# Altium schematic sheet top.SchDoc
size 420 x 297 mm; SheetNumber: 1; SheetTotal: 1
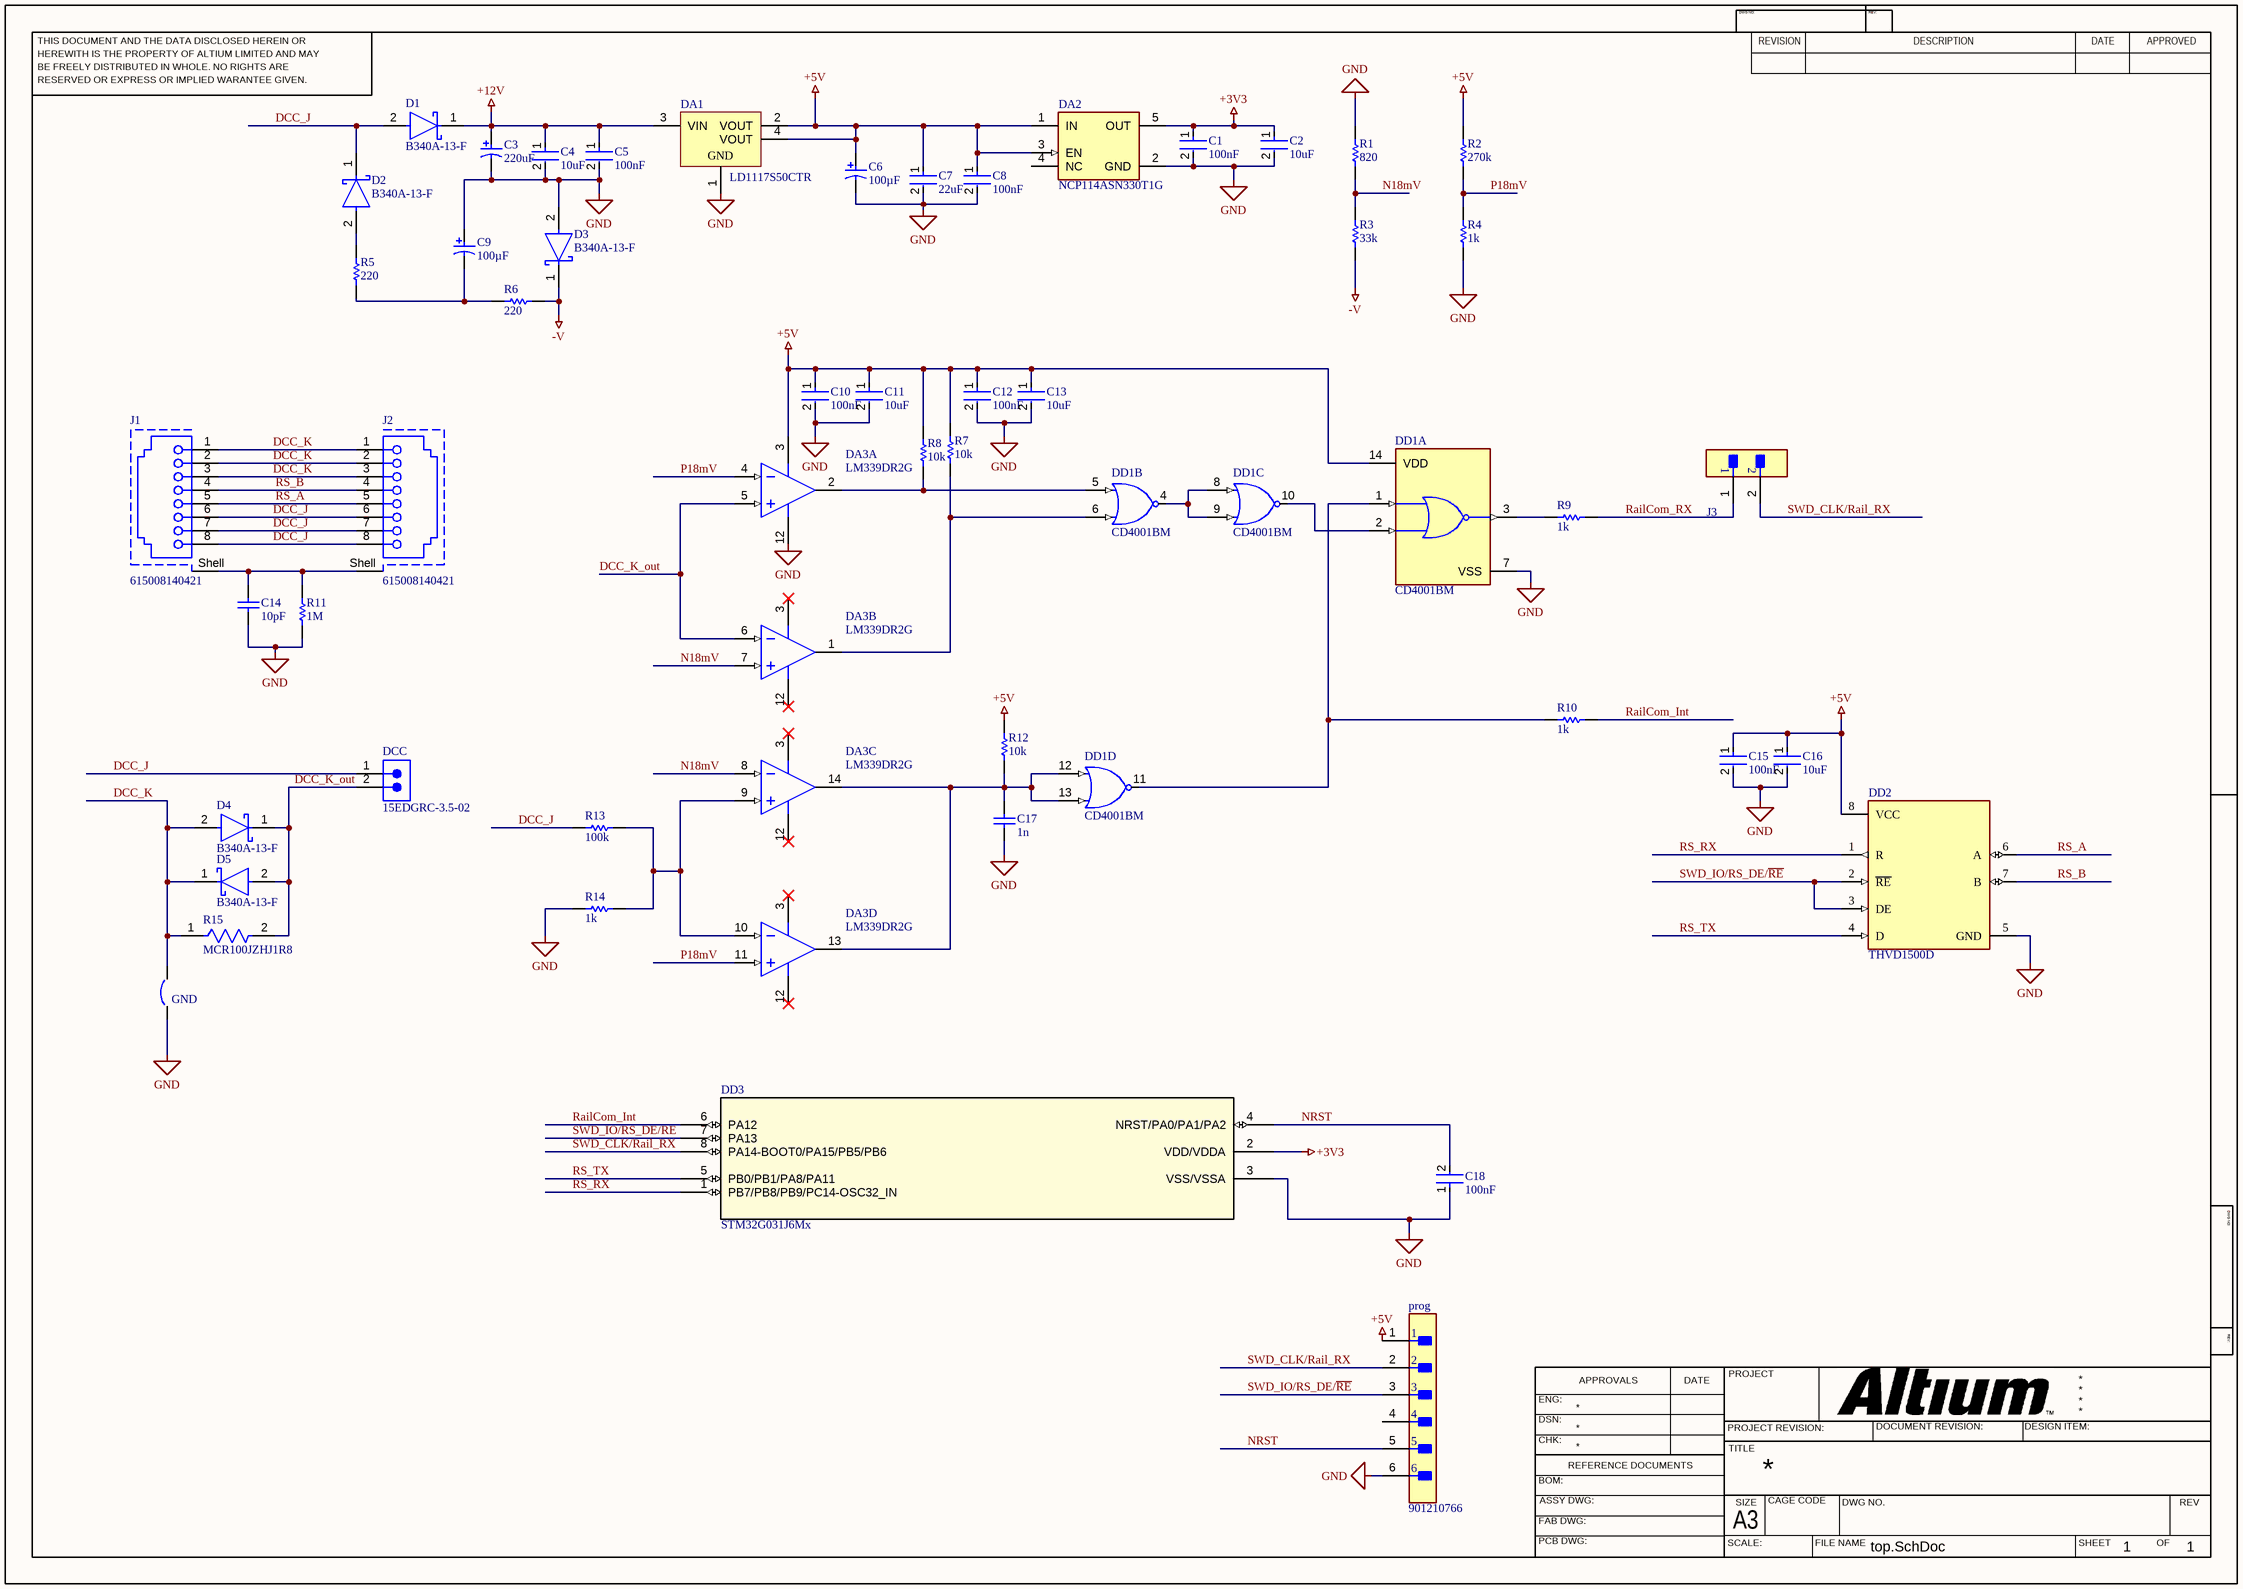
[diagram p0: top.SchDoc]

## Parts
C1  Capacitance: 100nF  [FP-CGA3E-0_3-0_1-IPC_C]  (hidden comment: CGA3E2X7R1H104K080AA)
C2  Capacitance: 10uF  [FP-GRM188-0_1-e0_2_0_55-IPC_C]  (hidden comment: GRM188R60J106ME47D)
C3  value 220uF  [PNSC-EEE-FK1E221P_N]  (hidden comment: EEE-FK1E221P)
C4  Capacitance: 10uF  [FP-GRM188-0_1-e0_2_0_55-IPC_C]  (hidden comment: GRM188R60J106ME47D)
C5  Capacitance: 100nF  [FP-CGA3E-0_3-0_1-IPC_C]  (hidden comment: CGA3E2X7R1H104K080AA)
C6  Capacitance: 100µF  [PNSC-FK-V-D8_V]  (hidden comment: EEEFK1E101XP)
C7  Capacitance: 22uF  [FP-GRM188-0_2-IPC_C]  (hidden comment: GRM188R61A226ME15D)
C8  Capacitance: 100nF  [FP-CGA3E-0_3-0_1-IPC_C]  (hidden comment: CGA3E2X7R1H104K080AA)
C9  Capacitance: 100µF  [PNSC-FK-V-D8_V]  (hidden comment: EEEFK1E101XP)
C10  Capacitance: 100nF  [FP-CGA3E-0_3-0_1-IPC_C]  (hidden comment: CGA3E2X7R1H104K080AA)
C11  Capacitance: 10uF  [FP-GRM188-0_1-e0_2_0_55-IPC_C]  (hidden comment: GRM188R60J106ME47D)
C12  Capacitance: 100nF  [FP-CGA3E-0_3-0_1-IPC_C]  (hidden comment: CGA3E2X7R1H104K080AA)
C13  Capacitance: 10uF  [FP-GRM188-0_1-e0_2_0_55-IPC_C]  (hidden comment: GRM188R60J106ME47D)
C14  value 10pF  [CAPC0603(1608)100_N]  (hidden comment: CAP 10pF 25V 0603(1608))
C15  Capacitance: 100nF  [FP-CGA3E-0_3-0_1-IPC_C]  (hidden comment: CGA3E2X7R1H104K080AA)
C16  Capacitance: 10uF  [FP-GRM188-0_1-e0_2_0_55-IPC_C]  (hidden comment: GRM188R60J106ME47D)
C17  value 1n  [CAPC1608X90X35NL10T15]  (hidden comment: GRM188R71H102KA01D)
C18  Capacitance: 100nF  [FP-CGA3E-0_3-0_1-MFG]  (hidden comment: CGA3E2X7R1H104K080AA)
D1  B340A-13-F  [FP-SMA-MFG]
D2  B340A-13-F  [FP-SMA-MFG]
D3  B340A-13-F  [FP-SMA-MFG]
D4  B340A-13-F  [FP-SMA-MFG]
D5  B340A-13-F  [FP-SMA-MFG]
DA1  LD1117S50CTR  [SOT-223_N]
DA2  NCP114ASN330T1G  [FP-483-MFG]
DA3  LM339DR2G  [ONSC-SOIC-14-751A-03_V]  (parts A,B,C,D of 4)
DCC  15EDGRC-3.5-02  [691305140002]
DD1  CD4001BM  [FP-D0014A-MFG]  (parts A,B,C,D of 4)
DD2  THVD1500D  [FP-D0008B-IPC_A]
DD3  STM32G031J6Mx  [SO-8]
GND  (no value)  [JP_SMD]
J1  615008140421  [615008140421]
J2  615008140421  [615008140421]
J3  M20-9990245  [FP-M20-9990245-MFG]  (value not drawn)
prog  901210766  [FP-901210766-MFG]
R1  value 820  [RESC1608X55X30NL15T15]  (hidden comment: ERJ3EKF8203V)
R2  value 270k  [RESC1608X55X30NL20T10]  (hidden comment: RK73H1JTTD2703F)
R3  value 33k  [RESC1608X55X30NL20T20]  (hidden comment: ERA3AEB333V)
R4  value 1k  [RESC1608X55X30NL15T15]  (hidden comment: ERJ-3EKF1001V)
R5  value 220  [RESC1608X55X30NL15T15]  (hidden comment: ERJ-3EKF2200V)
R6  value 220  [RESC1608X55X30NL15T15]  (hidden comment: ERJ-3EKF2200V)
R7  value 10k  [RESC1609X55X30NL15T15]  (hidden comment: ERJ3EKF1002V)
R8  value 10k  [RESC1609X55X30NL15T15]  (hidden comment: ERJ3EKF1002V)
R9  value 1k  [RESC1608X55X30NL15T15]  (hidden comment: ERJ-3EKF1001V)
R10  value 1k  [RESC1608X55X30NL15T15]  (hidden comment: ERJ-3EKF1001V)
R11  value 1M  [RESC1608X55X25NL10T15]  (hidden comment: RC0603FR-071ML)
R12  value 10k  [RESC1609X55X30NL15T15]  (hidden comment: ERJ3EKF1002V)
R13  value 100k  [RESC1608X55X30NL15T15]  (hidden comment: ERJ-3EKF1003V)
R14  value 1k  [RESC1608X55X30NL15T15]  (hidden comment: ERJ-3EKF1001V)
R15  MCR100JZHJ1R8  [FP-MCR100-IPC_C]

## Nets
+3V3: C1.1 C2.1 DA2.5(OUT) DD3.2(VDD/VDDA)
+5V: C6.1 C7.1 C8.1 C10.1 C11.1 C12.1 C13.1 C15.1 C16.1 DA1.2(VOUT) DA1.4(VOUT) DA2.1(IN) DA2.3(EN) DA3.3(VCC) DD1.14(VDD) DD2.8(VCC) prog.1 R2.2 R7.1 R8.1 R12.1
+12V: C3.1 C4.1 C5.1 D1.1(C) DA1.3(VIN)
-V: D3.1(C) R3.1 R6.2
GND: C1.2 C2.2 C3.2 C4.2 C5.2 C6.2 C7.2 C8.2 C9.1 C10.2 C11.2 C12.2 C13.2 C14.2 C15.2 C16.2 C17.1 C18.1 D3.2(A) DA1.1(GND) DA2.2(GND) DA3.12(GND) DD1.7(VSS) DD2.5(GND) DD3.3(VSS/VSSA) GND.1 prog.6 R1.2 R4.1 R11.2 R14.2
DCC_J: D1.2(A) D2.1(C) DCC.1 J1.6 J1.7 J1.8 J2.6 J2.7 J2.8 R13.2
DCC_K: D4.2(A) D5.1(C) GND.2 J1.1 J1.2 J1.3 J2.1 J2.2 J2.3 R15.1
DCC_K_out: D4.1(C) D5.2(A) DA3.5(IN1+) DA3.6(IN2-) DCC.2 R15.2
N18mV: DA3.7(IN2+) DA3.8(IN3-) R1.1 R3.2
NRST: C18.2 DD3.4(NRST/PA0/PA1/PA2) prog.5
P18mV: DA3.4(IN1-) DA3.11(IN4+) R2.1 R4.2
RailCom_Int: DD3.6(PA12) R10.1
RailCom_RX: J3.1 R9.1
RS_A: DD2.6(A) J1.5 J2.5
RS_B: DD2.7(B) J1.4 J2.4
RS_RX: DD2.1(R) DD3.1(PB7/PB8/PB9/PC14-OSC32_IN)
RS_TX: DD2.4(D) DD3.5(PB0/PB1/PA8/PA11)
SWD_CLK/Rail_RX: DD3.8(PA14-BOOT0/PA15/PB5/PB6) J3.2 prog.2
SWD_IO/RS_DE/~{RE}: DD2.2(~{RE}) DD2.3(DE) DD3.7(PA13) prog.3
NetC9_2: C9.2 R5.1 R6.1
NetC14_1: C14.1 J1.Shell J2.Shell R11.1
NetC17_2: C17.2 DA3.13(OUT4) DA3.14(OUT3) DD1.12(G) DD1.13(H) R12.2
NetD2_2: D2.2(A) R5.2
NetDA3_1: DA3.1(OUT2) DD1.6(D) R7.2
NetDA3_2: DA3.2(OUT1) DD1.5(C) R8.2
NetDA3_9: DA3.9(IN3+) DA3.10(IN4-) R13.1 R14.1
NetDD1_1: DD1.1(A) DD1.11(M) R10.2
NetDD1_2: DD1.2(B) DD1.10(L)
NetDD1_3: DD1.3(J) R9.2
NetDD1_4: DD1.4(K) DD1.8(E) DD1.9(F)

Not connected (* = marked no-connect by the designer): DA2 4(NC); prog 4

## Notes on the sheet
- THIS DOCUMENT AND THE DATA DISCLOSED HEREIN OR
- HEREWITH IS THE PROPERTY OF ALTIUM LIMITED AND MAY
- DWG NO:
- REVISION
- REV:
- DESCRIPTION
- DATE
- APPROVED
- BE FREELY DISTRIBUTED IN WHOLE. NO RIGHTS ARE
- RESERVED OR EXPRESS OR IMPLIED WARANTEE GIVEN.
- ENG:
- APPROVALS
- PROJECT
- DSN:
- CHK:
- REFERENCE DOCUMENTS
- PROJECT REVISION:
- TITLE
- DOCUMENT REVISION:
- DESIGN ITEM:
- BOM:
- FAB DWG:
- PCB DWG:
- ASSY DWG:
- SCALE:
- A3
- SIZE
- CAGE CODE
- FILE NAME
- DWG NO.
- SHEET
- OF
- REV

## Library data of the parts
C1 C5 C8 C10 C12 C15 C18 = CMP-2000-07546-2: Cap Ceramic 100nF 50V X7R 10% Pad SMD 0603 +125°C Automotive T/R; Weight: 7.1E-05oz; Composition: Ceramic; Max Operating Temperature: 125°C; Termination: SMD/SMT; Dielectric: X7R; Length: 1.6mm; Package Quantity: 1; REACH SVHC: No SVHC; Lead Free: Lead Free; Case Code (Metric): 1608; Min Operating Temperature: -55°C; Packaging: Tape and Reel; Tolerance: 10%; Voltage Rating: 50V; Case Code (Imperial): 0603; Case/Package: 0603; Voltage Rating (DC): 50V; Depth: 0.8mm; Radiation Hardening: No; Ratings: AEC-Q200; Mount: Surface Mount; Voltage: 50V; Thickness: 0.035inch; Width: 0.8mm; Height: 0.8mm
C2 C4 C11 C13 C16 = CMP-2006-02792-2: Chip Multilayer Ceramic Capacitors for General Purpose, 0603, 10uF, X5R, 15%, 20%, 6.3V; Packaging: Tape and Reel; Voltage Rating (DC): 6.3V; Width: 0.031inch; Termination: SMD/SMT; Dielectric: X5R; Package Quantity: 4000; Voltage Rating: 6.3V; Case/Package: 0603; Min Operating Temperature: -55°C; Voltage: 6.3V; Length: 1.6mm; Thickness: 0.035inch; Lead Free: Lead Free; Depth: 0.8mm; Case Code (Imperial): 0603; Max Operating Temperature: 85°C; Material: Ceramic; Height: 0.8mm; Tolerance: 20%; Mount: Surface Mount; REACH SVHC: No SVHC; Radiation Hardening: No; Case Code (Metric): 1608
C3 = CMP-1665-00017-3: Aluminum Electrolytic Capacitor, 220 uF, +/- 20%, 25 V, -55 to 105 degC, 2-Pin CAPAE, RoHS, Tape and Reel; Manufacturer: Panasonic; Voltage Rating: 25 V; ComponentLink2URL: http://industrial.panasonic.com/cdbs/www-data/pdf/RDE0000/ABA0000C1181.pdf; Height: 10.2 mm; Max Operating Temperature: 105 degC; PackageReference: EEE-FK1E221P; ComponentLink1Description: Manufacturer URL; ComponentLink1URL: http://www.panasonic.com/; Mount: Surface Mount; REACH SVHC: No SVHC; Min Operating Temperature: -55 degC; ComponentLink2Description: Datasheet; DatasheetVersion: 03/2016; Length: 10.2 mm; RoHSCompliant: true; Packaging: Tape and Reel; Package Quantity: 500; Lead Pitch: 3.1 mm; Pins: 2; PackageDescription: 2-Pin Electrolytic Aluminum Capacitor, Body 8.3 x 8.3 mm; Mounting Technology: Surface Mount
C6 C9 = CMP-2000-06206-1: Aluminum Electrolytic Capacitor, 100 uF, +/- 20%, 25 V, 2-Pin SMD (Size Code D8), -55 to 105 degC, RoHS, Tape and Reel; Manufacturer: Panasonic; Type: Can; Lifetime@Temperature: 2000Hrs@105°C; Rated Voltage: 25V; Ripple Current: 280mA; Impedance: 0.34O; Case Size/Dimension: Ø6.3x7.7mm; Operating Temp-Max: 105°C; Series: FK; Package URL: http://industrial.panasonic.com/cdbs/www-data/pdf/RDE0000/DME0000COL48.pdf; Mounting Technology: SurfaceMount; Package Description: 2-Pin Electrolytic Aluminum Capacitor, Body 6.6 x 6.6 mm; Datasheet Version: 03/2016; Datasheet URL: http://industrial.panasonic.com/cdbs/www-data/pdf/RDE0000/ABA0000C1181.pdf; Manufacturer URL: http://www.panasonic.com/; Package Reference: FK-V-D8; Operating Temp Range: -55to+105°C
C7 = CMP-2000-06337-3: Chip Multilayer Ceramic Capacitors for General Purpose, 0603, 22uF, X5R, 15%, 20%, 10V; Tolerance: 20%; Weight: 0.000222oz; Material: Ceramic; Depth: 0.8mm; Length: 1.6mm; Termination: SMD/SMT; Packaging: Tape and Reel; Width: 0.8mm; Voltage Rating: 10V; Case Code (Imperial): 0603; Mount: Surface Mount; Voltage Rating (DC): 10V; Case/Package: 0603; Thickness: 0.039inch; REACH SVHC: No SVHC; Dielectric: X5R; Height: 0.8mm; Package Quantity: 4000; Case Code (Metric): 1608; Min Operating Temperature: -55°C; Lead Free: Lead Free; Max Operating Temperature: 85°C
C14 = CMP-1035-00549-1: CAP 10pF 25V ±1% 0603 (1608 Metric) Thickness 1mm SMD; Case-EIA: 0603; Case-Metric: 1608; Tolerance: Â±1%; Technology: SMT; Max Thickness: 1 mm; Rated Voltage: 25 V
C17 = CMP-2006-02891-1: Manufacturer: Murata; Part Number: GRM188R71H102KA01D
D1-D5 = CMP-1667-00003-3: DIODE SCHOTTKY 40V 3A SMA; Max Forward Surge Current (Ifsm): 80A; Forward Voltage: 500mV; Polarity: Standard; Max Reverse Current: 500uA; Capacitance: 250pF; Element Configuration: Single; Mount: Surface Mount; Output Current: 3A; Radiation Hardening: No; Width: 2.92mm; Current Rating: 3A; Termination: SMD/SMT; Voltage: 40V; Series: -; Max Operating Temperature: 125°C; Current: 3A; Max Repetitive Reverse Voltage (Vrrm): 40V; Min Operating Temperature: -55°C; REACH SVHC: No SVHC; Number of Pins: 2; Average Rectified Current: 3A; Contact Plating: Tin; RoHS Compliant: Yes; Max Reverse Voltage (DC): 40V; Packaging: Tape and Reel; Height: 2.3mm; Length: 4.6mm; Case/Package: SMA; Weight: 0.002258oz; Peak Non-Repetitive Surge Current: 80A; Package Quantity: 5000; Lead Free: Lead Free; Forward Current: 3A; Voltage Rating (DC): 40V
DA1 = CMP-0244-00311-1: Fixed Low Drop Positive Voltage Regulator, 5V, 4-Pin SOT-223, Tape and Reel; PackageReference: SOT-223; PackageVersion: 2010; ComponentLink2URL: http://www.st.com/internet/com/TECHNICAL_RESOURCES/TECHNICAL_LITERATURE/DATASHEET/CD00000544.pdf; ComponentLink1URL: http://www.st.com; ComponentLink2Description: Datasheet; DatasheetVersion: 1/11/2011; ComponentLink1Description: Manufacturer URL; PackageDescription: 4-Pin SOT-223 Package, 6.5 x 3.5 mm Body, 2.3 mm Pitch, 7 mm Lead Span
DA2 = CMP-07128-000001-1: IC REG LINEAR 3.3V 300MA 5TSOP; Manufacturer: ON Semiconductor; Dropout Voltage: 150mV; Number Of Outputs: 1; Output Type: Fixed; Standoff Height: 0.01mm; Nominal Supply Current: 50uA; Accuracy Percentage: 1%; Max Junction Temp: +150°C; Min Supply Voltage: 1.7V; Max Supply Voltage: 5.5V; Output Voltage: 3.3V; Device Class L2: Power Management ICs; Digikey Description: IC REG LINEAR 3.3V 300MA 5TSOP; Footprint Url: https://www.onsemi.com/pub/Collateral/483.PDF; Temperature: to +150°C; RoHS: TRUE; Octopart: https://octopart.com/ncp114asn330t1g-on+semiconductor-74628742; Package: 483; Height: 1.1mm; Device Class L1: Integrated Circuits (ICs); Device Class L3: Voltage Regulators - Linear; ComponentLink2URL: https://www.onsemi.com/pub/Collateral/NCP114-D.PDF; Output Current: 300mA; Automotive: No; ComponentLink2Description: Datasheet; Manufacturer Part Number: NCP114ASN330T1G; Category: IC; Lead Free: Yes; Temperature Range High: +150°C
DA3 = CMP-1305-00036-1: Single Supply Quad Comparators, 0 to 70 degC, 14-Pin SOIC, Pb-Free, Tape and Reel; Manufacturer: On Semiconductor; IO Typ (mA): 16; ComponentLink3URL: http://www.onsemi.com/pub_link/Collateral/751A-03.PDF; RoHS: TRUE; Packing: Tape and Reel; ComponentLink2Description: Datasheet; ComponentLink2URL: http://www.onsemi.com/pub_link/Collateral/LM339-D.PDF; ComponentLink1Description: Manufacturer URL; PackageVersion: Rev. K, 05/2011; DatasheetVersion: Rev. 20; PackageReference: SOIC-14-751A-03; ComponentLink1URL: http://www.onsemi.com/; PartNumber: LM339DR2G; PackageDescription: 14-Pin Small Outline Integrated Circuit, Body 8.65 x 3.9 mm, Pitch 1.27 mm; ComponentLink3Description: Package Specification; Mounting Technology: Surface Mount
DCC = CMP-1502-01775-2: NexarPartId: 78871375; Gender: Male; Number of Pins: 2; Packaging: Box; RoHS: Non-Compliant; Lead Pitch: 3.5mm
DD1 = CMP-0806-00066-4: IC GATE NOR 4CH 2-INP 14SOIC; Output Current: 6.8mA; Number of Inputs: 2; Propagation Delay: 90ns; Number of Circuits: 4; Quiescent Current: 5uA; Max Supply Voltage: 18V; Schmitt Trigger Input: No; Min Supply Voltage: 3V; Number of Output Lines: 1; Low Level Output Current: 4.2mA; High Level Output Current: -4.2mA; Number of Elements: 4; Turn-On Delay Time: 90ns; Packaging: Rail/Tube; Mount: Surface Mount; Height: 1.58mm; Number of Bits: 4; Weight: 0.004564oz; Logic Function: NOR; Lead Free: Lead Free; Package Quantity: 50; Radiation Hardening: No; Length: 8.65mm; Min Operating Temperature: -55°C; Case/Package: SOIC; Number of Outputs: 1; Max Operating Temperature: 125°C; REACH SVHC: No SVHC; Contact Plating: Gold; Number of Pins: 14; Width: 3.91mm; Number of Input Lines: 2; Number of Gates: 4
DD2 = CMP-04875-000034-1: IC TRANSCEIVER HALF 1/1 8SOIC; Output Current per Channel: 75mA; Input Offset Voltage (Vos): 200uV; Number of Circuits: 1; Operating Supply Current: 1.6mA; Data Rate: 300Kbps; Receiver Hysteresis: 50mV; Slew Rate: 10V/µs; Simplex/Duplex: Half Duplex; Gain Bandwidth Product: 10MHz; Input Bias Current: 8pA; Case/Package: VSSOP; Max Operating Temperature: 125°C; Mount: Surface Mount; Min Operating Temperature: -40°C; Packaging: Tape and Reel; RoHS Compliant: Yes
DD3 = STM32G031J6Mx: The STM32G031x4/x6/x8 mainstream microcontrollers are based on high-performance Arm® Cortex®-M0+ 32-bit RISC core operating at up to 64 MHz frequency. / 32 Kbytes of Flash program memory and 8 Kbytes of SRAM. With 28pin UFQFPN 4x4x0.55 package; Manufacturer_Part_Number: stm32g0_so8_t1; Vendor: STMicroelectronics; Copyright: Copyright (C) 2018 Accelerated Designs. All rights reserved; RefDes: RefDes; Type: DEV; Value: Value
GND = Circuit Breaker: Solder: NO; Published: 24-Mar-1999; Revision: July-2002: Re-released for DXP Platform.; Publisher: Altium Limited
J1 J2 = CMP-1502-01733-2: NexarPartId: 18818182; Number of Contacts: 8; Voltage Rating (AC): 120V; Current Rating: 1.5A; Gender: Female; Shielding: Shielded; Insulation Resistance: 500MΩ; Number of Ports: 1; Direction: User Selectable; Contact Resistance: 20mΩ; Connector Type: RJ45, Socket; Flammability Rating: UL94 V-0; Orientation: Vertical; Height: 16.65mm; Contact Material: Copper; Width: 19.5mm; Mount: Through Hole; Operating Supply Voltage: 120V; Color: Black; Insulation Material: PBT; Lead Free: Lead Free; Length: 16.65mm; Max Operating Temperature: 85°C; Number of Positions: 8; RoHS: Compliant; Contact Plating: Gold; Number of Rows: 1; REACH SVHC: Unknown; Min Operating Temperature: -40°C; Termination: Through Hole; Housing Material: PBT; Depth: 16.4mm; Voltage Rating: 120V
J3 = CMP-15831-000105-1: CONN HEADER VERT 2POS 2.54MM; Working Voltage: 750V; Gender: Male; Number of Poles: 2; Current Rating: 3A; Mated Stacking Heights: 16.54mm; Contact Resistance: 25mR; Connector Type: Male Pin; Insulation Resistance: 10GR; Mating Cycles: 300; Voltage: 50V; Flammability Rating: UL94 V-0; Pitch: 2.54mm; Series: M20; Number of Contacts: 2; Height: 0.12inch; Min Operating Temperature: -40°C; Contact Finish - Mating: GOLD; Number of Positions: 2; Number of Rows: 1; Packaging: Bulk; Package Quantity: 1000; Voltage Rating (AC): 750V; Current: 3A; Mount: Through Hole; Case/Package: SIL; Orientation: Straight; Contact Shape: Square; Weight: 0.25lb; Radiation Hardening: No; Fastening Type: Pull; Length: 5.08mm; Depth: 2.54mm; Contact Mating Length: 0.24inch; Housing Material: Nylon; Reach SVHC Compliant: Yes; Insulation Material: Nylon; Color: Black; Width: 0.25inch; Insulation Color: Black; Contact Material: Brass; Contact Type: Male Pin; Termination: Solder; Max Operating Temperature: 105°C; Contact Plating: Gold; Housing Color: Black; Max Current Rating: 3A; Lead Pitch: 2.54mm
prog = CMP-04776-000096-1: CONN HEADER R/A 6POS 2.54MM; Manufacturer: Molex; Current Rating: 3A; Conn Orientation: Right Angle; Number Of Contacts: 6; Conn Gender: Male; Voltage Rating: 350V; Manufacturer Part Number: 901210766; ComponentLink2Description: Datasheet; ComponentLink2URL: https://www.molex.com/webdocs/datasheets/pdf/en-us/0901210766_PCB_HEADERS.pdf; Pitch: 2.54mm; Number Of Rows: 1; RoHS: TRUE; Category: Conn; Lead Free: Yes; Digikey Description: CONN HEADER R/A 6POS 2.54MM; Height: 3.6mm; Footprint Url: https://www.molex.com/pdm_docs/sd/901210766_sd.pdf; Device Class L1: Connectors; Temperature: -55°C to +125°C; Package: 0; Octopart: https://octopart.com/90121-0766-molex-655456; Device Class L3: unset; Temperature Range Low: -55°C; Contact Material: Gold,Nickel; Device Class L2: Headers and Wire Housings; Temperature Range High: +125°C; Automotive: No
R1 = CMP-2000-00657-1: Manufacturer: Panasonic; Part Number: ERJ3EKF8203V
R2 = CMP-2000-01368-1: Manufacturer: KOA Speer; Part Number: RK73H1JTTD2703F
R3 = CMP-2000-00041-1: Manufacturer: Panasonic; Part Number: ERA3AEB333V
R4 R9 R10 R14 = CMP-2000-00180-1: Manufacturer: Panasonic; Part Number: ERJ-3EKF1001V
R5 R6 = CMP-2000-00335-2: Chip Resistor, 220 Ohm, +/- 1%, 0.1 W, -55 to 155 degC, 0603 (1608 Metric), RoHS, Tape and Reel; Voltage Rating: 50 V; Resistance: 22 Ohm; Power Rating: 100 mW; Case\Package: 0603; ComponentLink2Description: Datasheet; PackageDescription: 2-Pin Surface Mount Device, Body 1.6 x 0.85 mm; PackageReference: 0603; ComponentLink1Description: Manufacturer URL; ComponentLink2URL: http://industrial.panasonic.com/cdbs/www-data/pdf/RDA0000/AOA0000C86.pdf; Height: 0.45 mm; Mount: Surface Mount; Case Code (Metric): 1608; Pins: 2; Width: 0.8 mm; Length: 1.6 mm; Package Quantity: 5000; Tolerance: 1%; ComponentLink1URL: http://www.panasonic.com/; Max Operating Temperature: 155 degC; Min Operating Temperature: -55 degC; RoHSCompliant: true; Packaging: Tape and Reel; Case Code (Imperial): 0603; DatasheetVersion: Apr-15; REACH SVHC: No SVHC; Voltage Rating (DC): 50 V
R7 R8 R12 = CMP-1012-00623-3: Chip Resistor, 10 KOhm, +/- 1%, 0.1 W, -55 to 155 degC, 0603 (1608 Metric), RoHS, Tape and Reel; Manufacturer: Panasonic; Voltage Rating: 75V; Case\/Package: 0603; Power Rating: 100mW; Resistance: 10KOhm; Temperature Coefficient: 100ppm\/degreesC; Number of Pins: 2; Package Reference: 603; Depth: 0.8mm; Mount: SurfaceMount; Package Description: 2-Pin Surface Mount Device, Body 1.6 x 0.85 mm; Datasheet Version: 02/2017; Length: 1.6mm; Lead Free: LeadFree; Height: 0.45mm; Number of Terminations: 2; Max Power Dissipation: 100mW; Min Operating Temperature: -55degC; Datasheet URL: https://industrial.panasonic.com/cdbs/www-data/pdf/RDA0000/AOA0000C304.pdf; Termination: SMD/SMT; Case Code (Metric): 1608; Case Code (Imperial): 0603; Tolerance: 1%; Max Operating Temperature: 155degC; RoHSCompliant: true; Voltage Rating (DC): 75V; Radiation Hardening: No; Packaging: TapeandReel; Composition: ThickFilm; Mounting Technology: SurfaceMount; Manufacturer URL: http://www.panasonic.com/; Width: 0.031inch; REACH SVHC: NoSVHC; Contact Plating: Tin; Military Standard: Not; Package Quantity: 1
R11 = CMP-1659-00056-1: Chip Resistor, 1 MOhm, +/- 1%, 100 mW, -55 to 155 degC, 0603 (1608 Metric), RoHS, Tape and Reel; Voltage Rating (DC): 25 V; Tolerance: 20%; Case\Package: Radial; Capacitance: 1 mF; Min Operating Temperature: -40 degC; PackageDescription: 2-Pin Surface Mount Device, Body 1.6 x 0.8 mm; ComponentLink1Description: Manufacturer URL; Radiation Hardening: No; DatasheetVersion: Rev. 4, 02/2016; REACH SVHC: No SVHC; Length: 20 mm; Max Operating Temperature: 85 degC; Diameter: 10 mm; Packaging: Bulk; Package Quantity: 200; PackageReference: 0603; Mount: Through Hole; ComponentLink1URL: http://www.yageo.com/; ComponentLink2URL: http://www.yageo.com/documents/recent/PYu-RC_Group_51_RoHS_L_04.pdf; ComponentLink2Description: Datasheet; Width: 0 inch; Lead Pitch: 5 mm; RoHSCompliant: true; Voltage Rating: 25 V; Height: 20 mm
R13 = CMP-2000-00182-1: Manufacturer: Panasonic; Part Number: ERJ-3EKF1003V
R15 = CMP-08839-000552-1: Thick Film Chip Resistor, 2512, 1.8Ω, 5%, +850/+150ppm/°C, 1W, 200V; Resistance: 1.8R; Temperature Coefficient: 850ppm/°C; Min Operating Temperature: -55°C; Max Power Dissipation: 1W; Power Rating: 1W; Case Code (Imperial): 2512; Case/Package: 2512; Height: 0.55mm; Number of Terminations: 2; Features: Automotive AEC-Q200; Max Operating Temperature: 125°C; Series: MCR; Case Code (Metric): 6432; RoHS Compliant: Yes; Width: 3.2mm; Tolerance: 5%; Length: 6.3mm; Packaging: Tape and Reel; Voltage Rating (DC): 200V